# EAGLE design Signals_10mm (EAGLE 9.6.2)
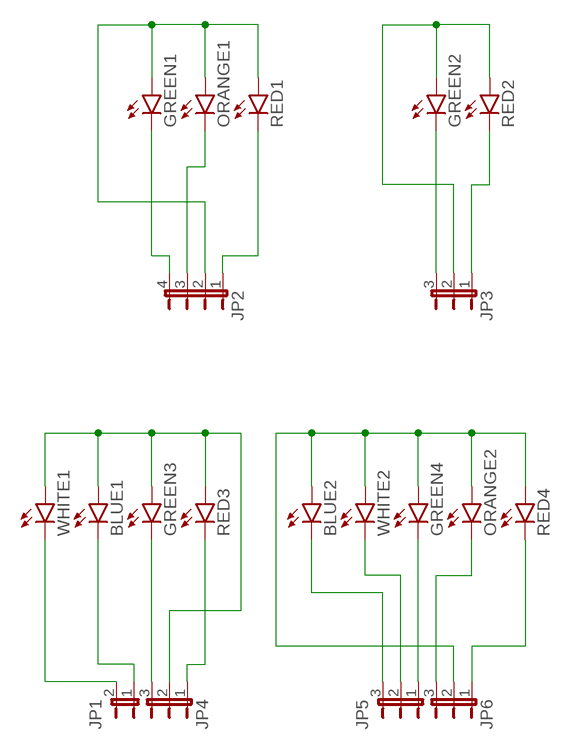
[diagram p0: schematic, sheet 1]

## Parts
BLUE1  LED10MM  [LED10MM]
BLUE2  LED10MM  [LED10MM]
GREEN1  LED10MM  [LED10MM]
GREEN2  LED10MM  [LED10MM]
GREEN3  LED10MM  [LED10MM]
GREEN4  LED10MM  [LED10MM]
JP1  JP1E  [JP1]
JP2  JP4E  [JP4]
JP3  JP2E  [JP2]
JP4  JP2E  [JP2]
JP5  JP2E  [JP2]
JP6  JP2E  [JP2]
ORANGE1  LED10MM  [LED10MM]
ORANGE2  LED10MM  [LED10MM]
RED1  LED10MM  [LED10MM]
RED2  LED10MM  [LED10MM]
RED3  LED10MM  [LED10MM]
RED4  LED10MM  [LED10MM]
WHITE1  LED10MM  [LED10MM]
WHITE2  LED10MM  [LED10MM]

## Nets
N$1: GREEN1.A JP2.2 ORANGE1.A RED1.A
N$2: JP2.3 ORANGE1.K(C)
N$3: JP2.1 RED1.K(C)
N$4: JP1.2 WHITE1.K(C)
N$5: GREEN1.K(C) JP2.4
N$6: GREEN2.A JP3.2 RED2.A
N$7: BLUE1.K(C) JP1.1
N$8: GREEN2.K(C) JP3.3
N$9: JP3.1 RED2.K(C)
N$10: GREEN3.K(C) JP4.3
N$11: JP4.1 RED3.K(C)
N$12: BLUE1.A GREEN3.A JP4.2 RED3.A WHITE1.A
N$13: JP6.1 RED4.K(C)
N$14: JP6.3 ORANGE2.K(C)
N$15: GREEN4.K(C) JP5.1
N$16: JP5.2 WHITE2.K(C)
N$17: BLUE2.K(C) JP5.3
N$18: BLUE2.A GREEN4.A JP6.2 ORANGE2.A RED4.A WHITE2.A

## Library data of the parts
BLUE1 BLUE2 GREEN1-GREEN4 ORANGE1 ORANGE2 RED1-RED4 WHITE1 WHITE2 = led:LED: LED OSRAM: - CHIPLED LG R971, LG N971, LY N971, LG Q971, LY Q971, LO R971, LY R971 LH N974, LH R974 LS Q976, LO Q976, LY Q976 LO Q996 - Hyper CHIPLED LW Q18S LB Q993, LB Q99A, LB R99A - SideLED LS A670, LO A670, LY A670, LG A670, LP A670 LB A673, LV A673, LT A673, LW A673 LH A674 LY A675 LS A676, LA A676, LO A676, LY A676, LW A676 LS A679, LY A679, LG A679 - Hyper Micro SIDELED® LS Y876, LA Y876, LO Y876, LY Y876 LT Y87S - SmartLED LW L88C, LW L88S LB L89C, LB L89S, LG L890 LS L89K, LO L89K, LY L89K LS L896, LA L896, LO L896, LY L896 - TOPLED LS T670, LO T670, LY T670, LG T670, LP T670 LSG T670, LSP T670, LSY T670, LOP T670, LYG T670 LG T671, LOG T671, LSG T671 LB T673, LV T673, LT T673, LW T673 LH T674 LS T676, LA T676, LO T676, LY T676, LB T676, LH T676, LSB T676, LW T676 LB T67C, LV T67C, LT T67C, LS T67K, LO T67K, LY T67K, LW E67C LS E67B, LA E67B, LO E67B, LY E67B, LB E67C, LV E67C, LT E67C LW T67C LS T679, LY T679, LG T679 LS T770, LO T770, LY T770, LG T770, LP T770 LB T773, LV T773, LT T773, LW T773 LH T774 LS E675, LA E675, LY E675, LS T675 LS T776, LA T776, LO T776, LY T776, LB T776 LHGB T686 LT T68C, LB T68C - Hyper Mini TOPLED® LB M676 - Mini TOPLED Santana® LG M470 LS M47K, LO M47K, LY M47K Source: http://www.osram.convergy.de LUXEON: - LUMILED® LXK2-PW12-R00, LXK2-PW12-S00, LXK2-PW14-U00, LXK2-PW14-V00 LXK2-PM12-R00, LXK2-PM12-S00, LXK2-PM14-U00 LXK2-PE12-Q00, LXK2-PE12-R00, LXK2-PE12-S00, LXK2-PE14-T00, LXK2-PE14-U00 LXK2-PB12-K00, LXK2-PB12-L00, LXK2-PB12-M00, LXK2-PB14-N00, LXK2-PB14-P00, LXK2-PB14-Q00 LXK2-PR12-L00, LXK2-PR12-M00, LXK2-PR14-Q00, LXK2-PR14-R00 LXK2-PD12-Q00, LXK2-PD12-R00, LXK2-PD12-S00 LXK2-PH12-R00, LXK2-PH12-S00 LXK2-PL12-P00, LXK2-PL12-Q00, LXK2-PL12-R00 Source: www.luxeon.com KINGBRIGHT: KA-3528ASYC Source: www.kingbright.com
JP1 = jumper:JP1E: JUMPER
JP2 = jumper:JP4E: JUMPER
JP3-JP6 = jumper:JP2E: JUMPER

## Board
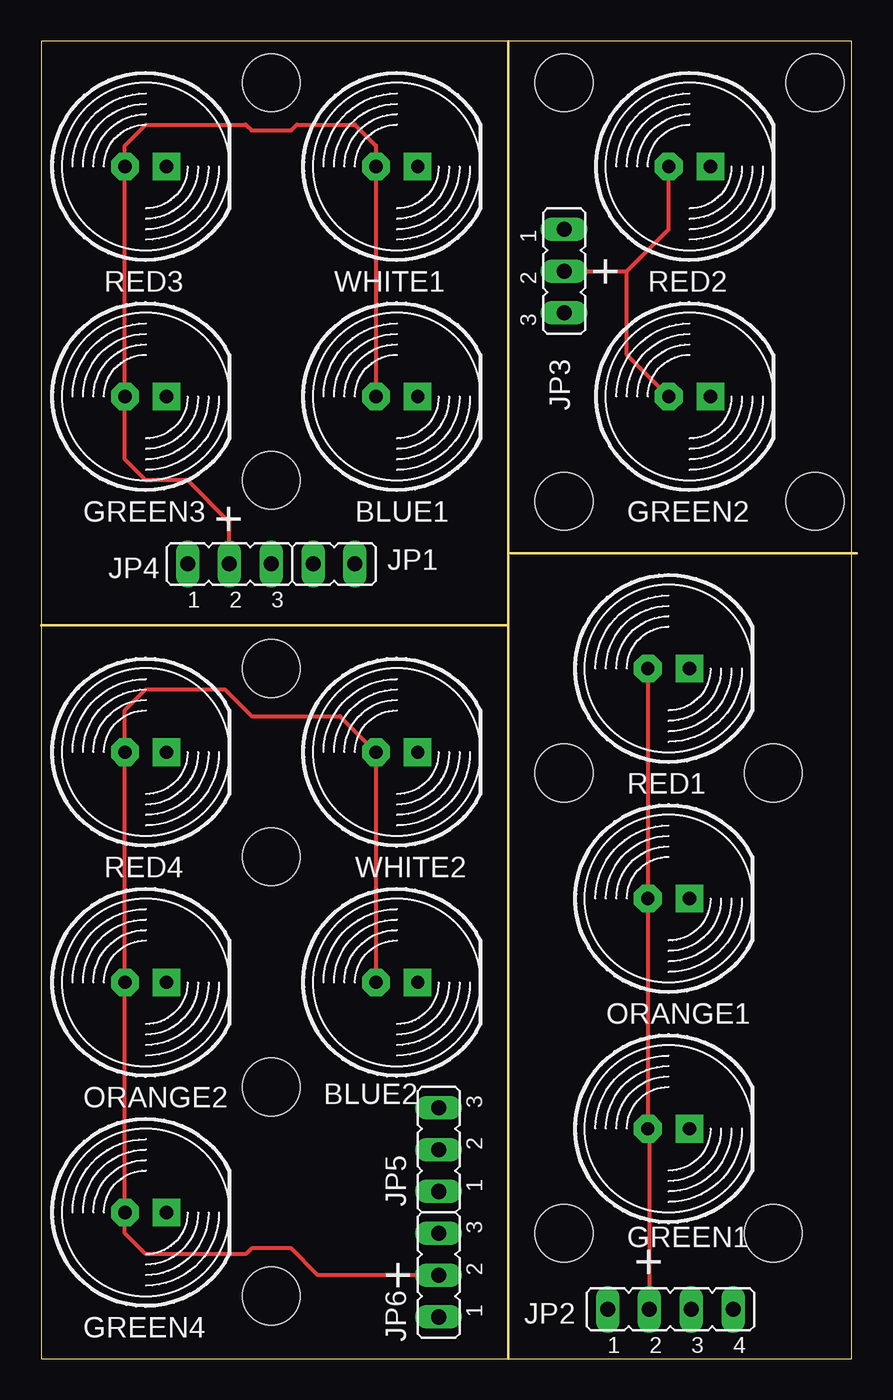
[diagram p1: board, top side]
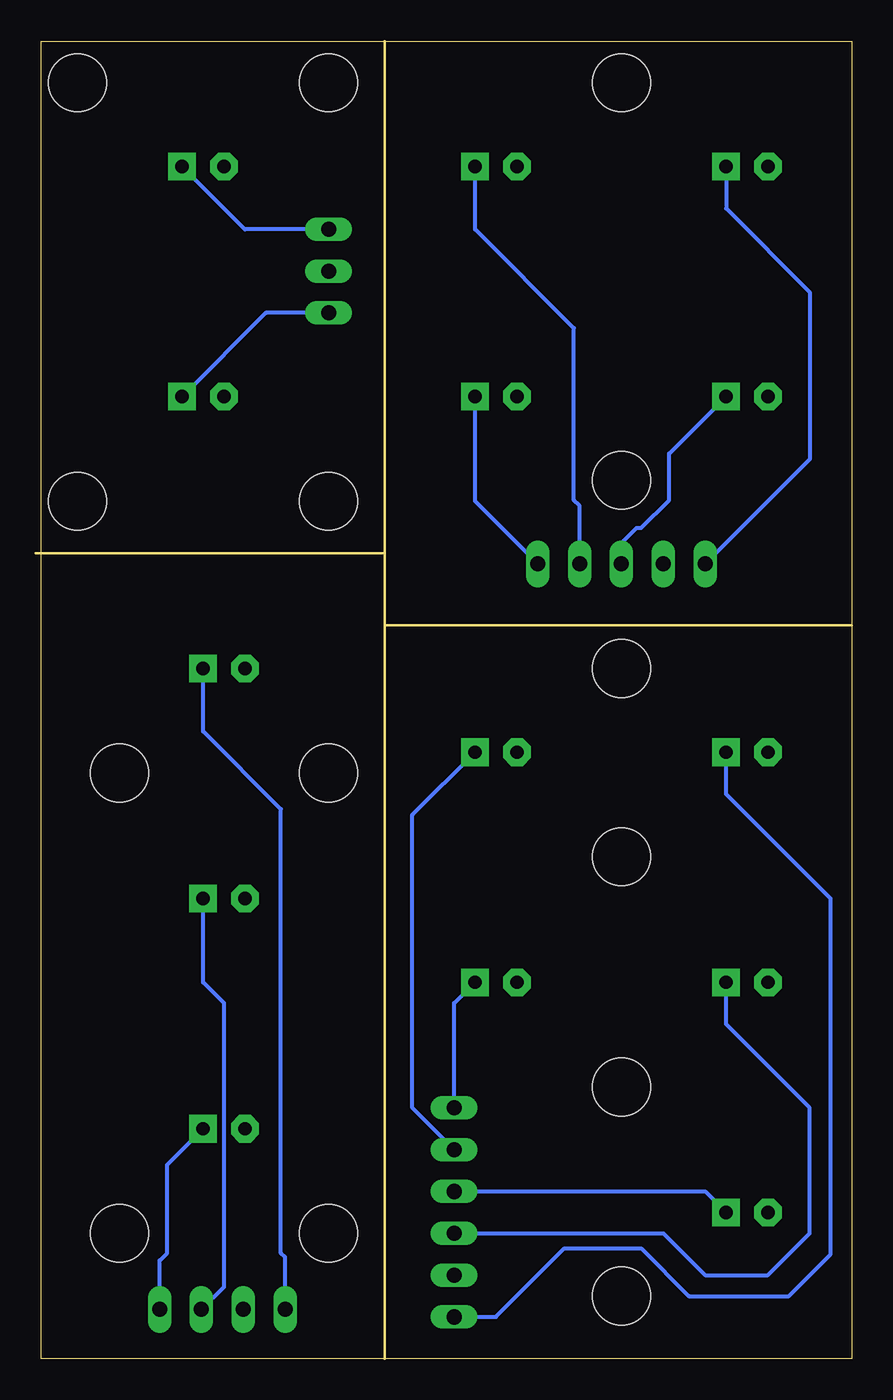
[diagram p2: board, bottom side, seen from below]

Size 49.2 x 80 mm. Coordinates in mm from the lower left corner, seen from the top.
Outline: 0,0 49.2,0 49.2,80 0,80 0,0
Copper layers (1*16): Top 0.035mm / dielectric 1.5mm / Bottom 0.035mm
Design rules "default": minimum track width 6mil, minimum drill 0.35mm, track to track 6mil, track to pad 6mil, pad to pad 6mil, via to via 6mil, smd to smd 6mil, copper to edge 40mil, drill to drill 6mil, minimum pad ring 10mil, minimum via ring 8mil, stop-mask expansion 4mil, vias tented up to drill 0mil, thermal gap 10mil
Holes 3.5 mm at 44.45,35.56 31.75,7.62 13.97,41.91 13.97,3.81 13.97,77.47 13.97,53.34 46.99,52.07 46.99,77.47 13.97,30.48 13.97,16.51 31.75,35.56 44.45,7.62 31.75,77.47 31.75,52.07
Milling: 5 lines

### Footprints (pad centres in the part's own frame; a part is rotated, then mirrored left to right if it is on the bottom)
LED10MM = drill 0.813 pad 1.676 octagon: A -1.27,0 | drill 0.813 pad 1.676 square: K 1.27,0
JP1 = drill 0.914 long: 1 0,-1.27; 2 0,1.27
JP4 = drill 0.914 long: 1 -3.81,0; 2 -1.27,0; 3 1.27,0; 4 3.81,0
JP2 = drill 0.914 long: 1 -2.54,0; 2 0,0; 3 2.54,0

### Placement (x,y rotation side)
BLUE1  21.59,58.42 0 top
BLUE2  21.59,22.86 0 top
GREEN1  38.1,13.97 0 top
GREEN2  39.37,58.42 0 top
GREEN3  6.35,58.42 0 top
GREEN4  6.35,8.89 0 top
JP1  17.78,48.26 90 top
JP2  38.2,3 0 top
JP3  31.75,66.04 270 top
JP4  11.43,48.26 0 top
JP5  24.13,12.7 90 top
JP6  24.13,5.08 90 top
ORANGE1  38.1,27.94 0 top
ORANGE2  6.35,22.86 0 top
RED1  38.1,41.91 0 top
RED2  39.37,72.39 0 top
RED3  6.35,72.39 0 top
RED4  6.35,36.83 0 top
WHITE1  21.59,72.39 0 top
WHITE2  21.59,36.83 0 top

### Tracks (layer width: path | path; a pad name or v marks a point on that pad's centre or on a via)
N$1
  Top 0.254: RED1.A ORANGE1.A GREEN1.A 36.93,13.87 JP2.2
N$2
  Bottom 0.254: JP2.3 38.1,4.37 38.1,21.59 39.37,22.86 ORANGE1.K
N$3
  Bottom 0.254: JP2.1 34.39,6.17 34.64,6.42 34.64,33.37 39.37,38.1 RED1.K
N$4
  Bottom 0.254: JP1.2 16.51,51.79 16.86,52.14 16.86,62.58 22.86,68.58 WHITE1.K
N$5
  Bottom 0.254: JP2.4 42.01,5.97 41.56,6.42 41.56,11.78 GREEN1.K
N$6
  Top 0.254: JP3.2 35.56,66.04 | 35.56,66.04 38.1,68.58 RED2.A | GREEN2.A 35.56,60.96 35.56,66.04
N$7
  Bottom 0.254: JP1.1 22.86,52.07 BLUE1.K
N$8
  Bottom 0.254: JP3.3 35.56,63.5 GREEN2.K
N$9
  Bottom 0.254: JP3.1 36.83,68.58 RED2.K
N$10
  Bottom 0.254: JP4.3 13.97,49.53 13.05,50.45 12.77,50.45 11.08,52.14 11.08,54.96 GREEN3.K
N$11
  Bottom 0.254: JP4.1 2.54,54.61 2.54,64.77 7.62,69.85 RED3.K
N$12
  Top 0.254: JP4.2 11.43,50.8 8.89,53.34 6.35,53.34 5.08,54.61 GREEN3.A RED3.A 5.08,73.66 6.35,74.93 12.42,74.93 12.77,74.58 15.17,74.58 15.52,74.93 19.05,74.93 20.32,73.66 WHITE1.A BLUE1.A
N$13
  Bottom 0.254: JP6.1 21.59,2.54 17.43,6.7 12.77,6.7 9.88,3.81 3.81,3.81 1.27,6.35 1.27,27.94 7.62,34.29 RED4.K
N$14
  Bottom 0.254: JP6.3 11.43,7.62 8.89,5.08 5.08,5.08 2.54,7.62 2.54,15.24 7.62,20.32 ORANGE2.K
N$15
  Bottom 0.254: JP5.1 8.89,10.16 GREEN4.K
N$16
  Bottom 0.254: JP5.2 26.67,15.24 26.67,33.02 WHITE2.K
N$17
  Bottom 0.254: JP5.3 24.13,21.59 BLUE2.K
N$18
  Top 0.254: BLUE2.A WHITE2.A 18.13,39.02 12.77,39.02 11.15,40.64 6.35,40.64 5.08,39.37 RED4.A ORANGE2.A GREEN4.A 5.08,7.62 6.35,6.35 12.42,6.35 12.77,6.7 15.17,6.7 16.79,5.08 JP6.2

### Text on the board
tNames: + | + | + | +